# Altium project Relia ver2.PrjPcb (part 2 of 2)

## Sheet Motor_Outputs.SchDoc
size A4; SheetNumber: 5; SheetTotal: 5
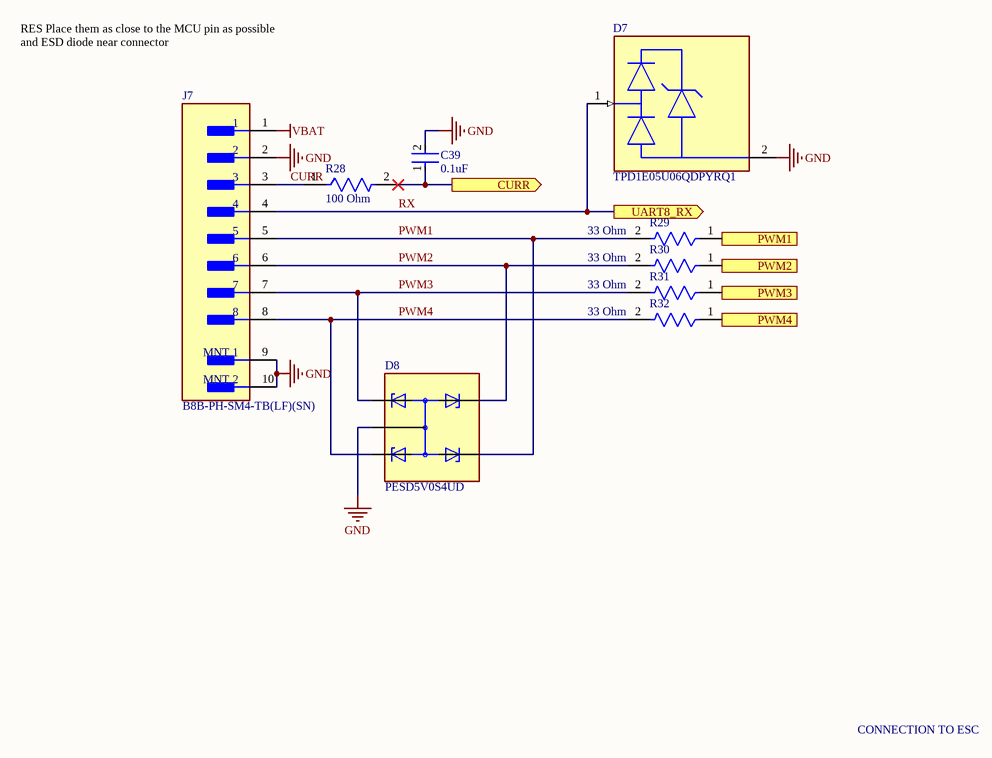
[diagram p4: Motor_Outputs.SchDoc]

### Parts
C39  0.1uF  [FP-C0402-BB-MFG]
D7  TPD1E05U06QDPYRQ1  [FP-DPY0002A-MFG]
D8  PESD5V0S4UD  [SOT457]
J7  B8B-PH-SM4-TB(LF)(SN)  [FP-B8B-PH-SM4-TB_LF_SN-MFG]
R28  100 Ohm  [FP-MCS0402-IPC_A]
R29  33 Ohm  [FP-RMCF0402-MFG]
R30  33 Ohm  [FP-RMCF0402-MFG]
R31  33 Ohm  [FP-RMCF0402-MFG]
R32  33 Ohm  [FP-RMCF0402-MFG]

### Ports
CURR (out, see EMP_FC_Main[2C], MCU_Core[4B]), PWM1 (in, see EMP_FC_Main[2C], MCU_Core[4B]), PWM2 (in, see EMP_FC_Main[2C], MCU_Core[4B]), PWM3 (in, see EMP_FC_Main[2C], MCU_Core[4B]), PWM4 (in, see EMP_FC_Main[2C], MCU_Core[4B]), UART8_RX (out, see EMP_FC_Main[2C], MCU_Core[3A])

### Nets
GND: C39.2 D7.2(GND) D8.2(CA) J7.2 J7.9(MNT_1) J7.10(MNT_2)
VBAT: J7.1
CURR: J7.3 R28.1
PWM1: D8.4(K3) J7.5 R29.2
PWM2: D8.6(K4) J7.6 R30.2
PWM3: D8.1(K1) J7.7 R31.2
PWM4: D8.3(K2) J7.8 R32.2
RX: D7.1(I/O) J7.4 ; port UART8_RX
NetC39_1: C39.1 R28.2 ; port CURR
NetR29_1: R29.1 ; port PWM1
NetR30_1: R30.1 ; port PWM2
NetR31_1: R31.1 ; port PWM3
NetR32_1: R32.1 ; port PWM4

Not connected (* = marked no-connect by the designer): D8 5(CA)

### Notes on the sheet
- RES Place them as close to the MCU pin as possible and ESD diode near connector
- CONNECTION TO ESC

### Library data of the parts
C39 = CMP-03020-002733-1: CAP CER 0.1UF 10V X7R 0402; Manufacturer: Kemet; Manufacturer Part Number: C0402C104K8RACAUTO; Material: Ceramic; Value: 0.10 μF; Tolerance: 0.1; Temperature Coefficient: 15%; ComponentLink2Description: Datasheet; Automotive: No; Digikey Description: CAP CER 0.1UF 10V X7R 0402; Temperature Range Low: -55°C; Ipc Land Pattern Name: CAPC10050X50; Lead Free: Yes; Category: Cap; Package: C0402-BB; Octopart: https://octopart.com/c0402c104k8racauto-kemet-9145167; Voltage Rating: 10 V; Device Class L2: Capacitors; Capacitance: 0.10 μF; Temperature Range High: +125°C; Height: 0.55mm; ComponentLink2URL: https://content.kemet.com/datasheets/KEM_C1002_X7R_SMD.pdf; Temperature: -55°C to +125°C; Device Class L1: Passive Components; Temperature Characteristic: X7R; RoHS: TRUE; Device Class L3: Ceramic Capacitors
D7 = CMP-04989-000010-1: TVS DIODE 5.5V 14V 2X1SON; Number of Channels: 1; Interface: LVDS; Max Operating Temperature: 125°C; Min Operating Temperature: -40°C; RoHS Compliant: Yes; Lead Free: Lead Free
D8 = PESD5V0S4UD: 13V Clamp 20A (8/20Âµs) Ipp Tvs Diode Surface Mount 6-TSOP; MF: NXP Semiconductors; SnapEDA_Link: https://www.snapeda.com/parts/PESD5V0S4UD/NXP+Semiconductors/view-part/?ref=snap; Package: None; Value: *; MP: PESD5V0S4UD; Check_prices: https://www.snapeda.com/parts/PESD5V0S4UD/NXP+Semiconductors/view-part/?ref=eda
J7 = CMP-17439-000195-1: CONN HEADER SMD 8POS 2MM; Current Rating: 2A; Insulation Resistance: 1GR; Mated Stacking Heights: 8.6mm; Gender: Male; Contact Resistance: 20mR; Number of Contacts: 8; Max Voltage Rating (AC): 100V; Pitch: 2mm; Fastening Type: Detent; Min Operating Temperature: -25°C; Contact Type: Male Pin; Series: PH; Contact Material: Copper Alloy; Termination: Solder; Contact Shape: Square; Depth: 5mm; Insulation Color: Natural; Housing Material: Polyamide; Max Current Rating: 2A; Color: White; Connector Type: Header; REACH SVHC: No SVHC; Insulation Material: Nylon; Number of Positions: 8; Height: 9.4mm; Width: 5.5mm; Max Operating Temperature: 85°C; Mount: Surface Mount; Orientation: Straight; Packaging: Tape and Reel; Working Voltage: 100V; Contact Mating Length: 0.13inch; Voltage Rating (AC): 100V; Housing Color: Beige; Length: 19.95mm; Contact Plating: Tin; Number of Poles: 8; Lead Free: Lead Free; Voltage Rating: 100V; Lead Pitch: 2mm; Contact Finish - Mating: TIN; Flammability Rating: UL94 V-0; Number of Rows: 1
R28 = CMP-02407-000150-1: RES SMD 1.2K OHM 1% 1/10W 0402; Resistance: 100R; Max Power Dissipation: 200mW; Tolerance: 0.5%; Temperature Coefficient: 25ppm/°C; Packaging: Cut Tape; Min Operating Temperature: -55°C; Case Code (Imperial): 0402; Features: Automotive AEC-Q200; Case/Package: 0402; Number of Terminations: 2; Max Operating Temperature: 175°C; Composition: Thin Film; Case Code (Metric): 1005
R29-R32 = CMP-26527-001180-1: 33Ω ±5% 0.063W 0402 Thick Film Chip Resistor AEC-Q200 compliant; Resistance: 33R; Max Power Dissipation: 63mW; Temperature Coefficient: 100ppm/°C; Case Code (Metric): 1005; Number of Terminations: 2; Mount: Surface Mount; Case Code (Imperial): 0402; Width: 0.02inch; Max Operating Temperature: 155°C; Radiation Hardening: No; Series: RMCF; Tolerance: 5%; Min Operating Temperature: -55°C; Length: 0.039inch; Case/Package: 0402; RoHS Compliant: Yes; Packaging: Tape and Reel; Features: Automotive AEC-Q200; Height: 0.016inch; Contact Plating: Tin; Resistor Type: Thick Film

## Nets that join several sheets
+3V3_ANALOG: Power_Management (C51.1 C52.1 FB1.2), MCU_Core (26 pins)
+3V3_MAIN: Power_Management (7 pins), MCU_Core (22 pins), Communication (11 pins)
GND: Power_Management (36 pins), MCU_Core (50 pins), Communication (46 pins), Motor_Outputs (6 pins)
VBAT: Power_Management (D9.2 D10.1), Motor_Outputs (J7.1)
VBUS: Power_Management (C48.1 R38.2 U8.2 U8.2_1), Communication (C1.1 C2.1 FL1.2 U1.5)
VDD_5V: Power_Management (6 pins), Communication (16 pins)
GPS_SCL: MCU_Core (U3.95), Communication (J9.6 R13.2)
GPS_SDA: MCU_Core (U3.96), Communication (J9.5 R14.2)
NetC39_1: MCU_Core (U3.29), Motor_Outputs (C39.1 R28.2)
NetJ8_1: Power_Management (J8.1 R36.1), MCU_Core (U3.59)
NetJ8_2: Power_Management (J8.2 R37.1), MCU_Core (U3.60)
NetR11_1: MCU_Core (U3.87), Communication (R11.1)
NetR29_1: MCU_Core (U3.22), Motor_Outputs (R29.1)
NetR30_1: MCU_Core (U3.23), Motor_Outputs (R30.1)
NetR31_1: MCU_Core (U3.24), Motor_Outputs (R31.1)
NetR32_1: MCU_Core (U3.25), Motor_Outputs (R32.1)
NetU2_1: MCU_Core (U3.82), Communication (U2.1)
NetU2_4: MCU_Core (U3.81), Communication (U2.4)
NRST: MCU_Core (C23.1 R20.2 S2.1 U3.14), Communication (J2.4)
RX: MCU_Core (U3.97), Motor_Outputs (D7.1 J7.4)
SD_CLK: MCU_Core (U3.79), Communication (J3.5)
SD_CMD: MCU_Core (U3.83), Communication (J3.3 R6.2)
SD_D1: MCU_Core (U3.65), Communication (J3.8 R3.2)
SD_D2: MCU_Core (U3.66), Communication (J3.1 R4.2)
SD_D3: MCU_Core (U3.78), Communication (J3.2 R5.2)
SD_DETECT: MCU_Core (U3.7), Communication (J3.SWB R8.1)
SD_DO: MCU_Core (U3.64), Communication (J3.7 R2.2)
SWCLK: MCU_Core (U3.76), Communication (J2.3)
SWDIO: MCU_Core (U3.72), Communication (J2.2)
UART3_RX: MCU_Core (U3.56), Communication (J9.2)
UART3_TX: MCU_Core (U3.55), Communication (J9.3)
USART1_RX: MCU_Core (U3.69), Communication (J6.3)
USART1_TX: MCU_Core (U3.68), Communication (J6.2)
USB_N: MCU_Core (U3.70), Communication (R1.2)
USB_P: MCU_Core (U3.71), Communication (R7.2)